# EAGLE schematic DBSchematics (EAGLE 8.2.1)
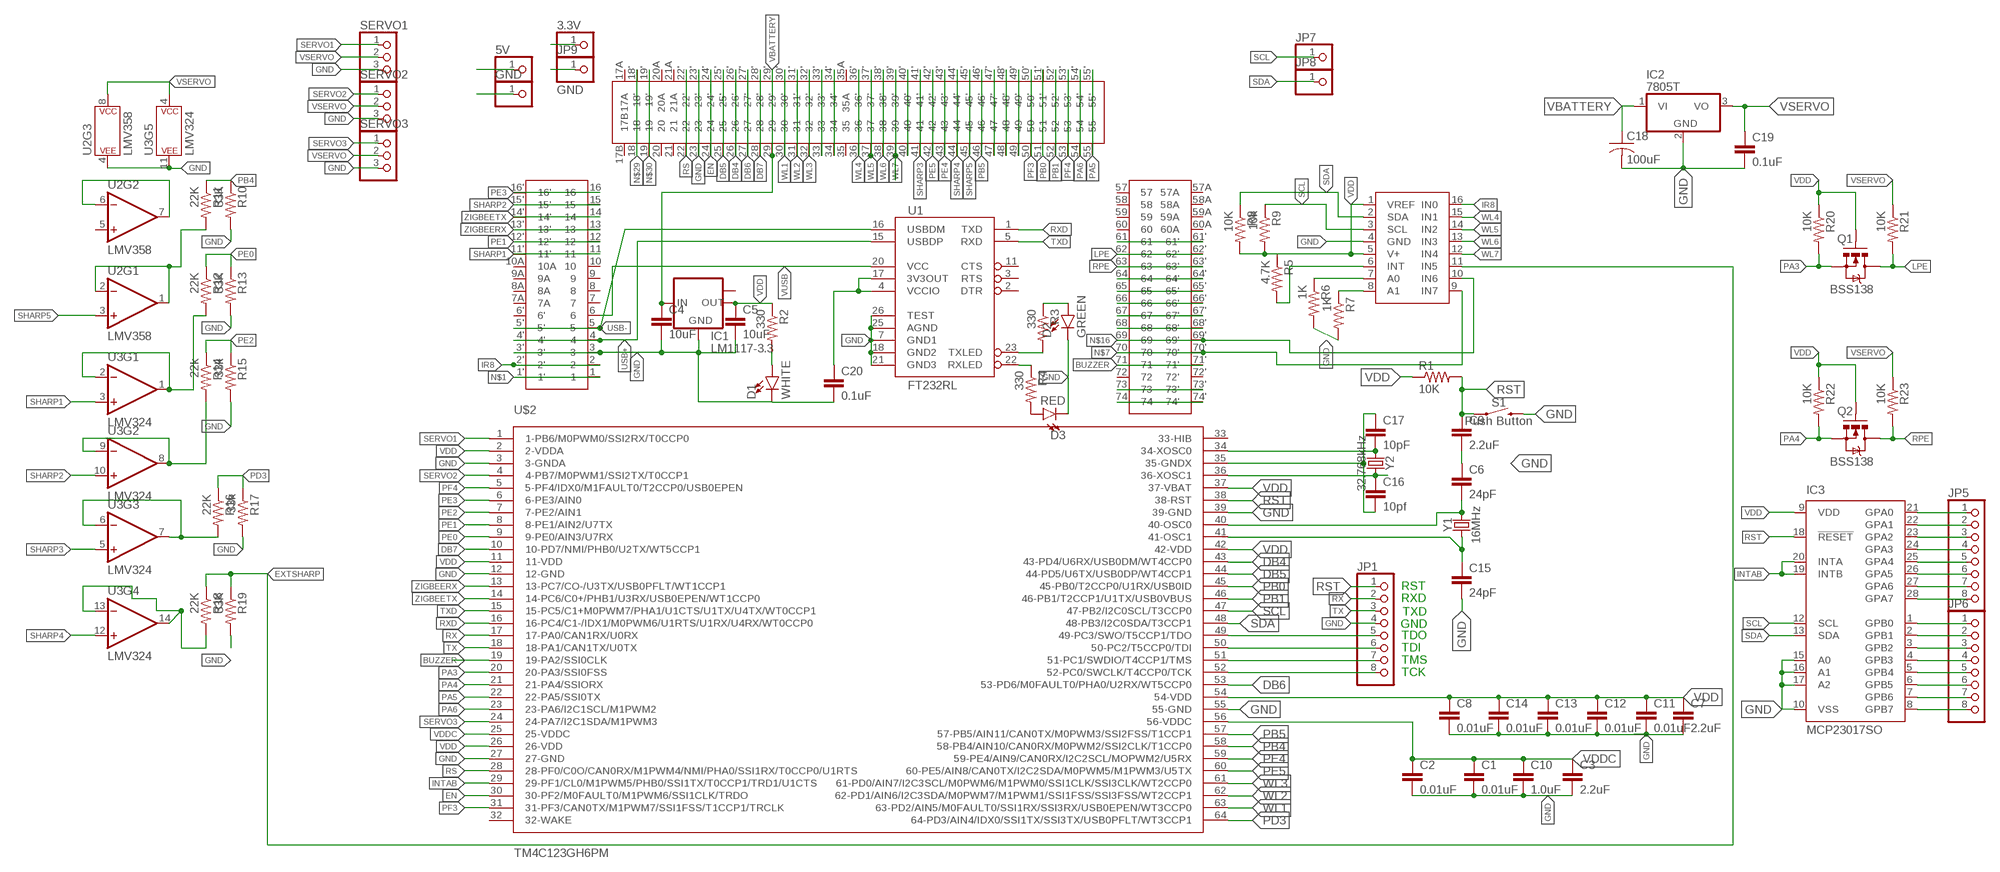
[diagram p0: schematic, sheet 1]

## Parts
3.3V  PINHD-1X1  [1X01]
5V  PINHD-1X1  [1X01]
C1  0.01uF  2.2UF-CERCAP-10009  [1206]
C2  0.01uF  2.2UF-CERCAP-10009  [1206]
C3  2.2uF  2.2UF-1206-50V-10%  [1206]
C4  10uF  10UF-1206-6.3V-20%  [1206]
C5  10uF  10UF-1206-6.3V-20%  [1206]
C6  24pF  2.2UF-CERCAP-10009  [1206]
C7  2.2uF  2.2UF-CERCAP-10009  [1206]
C8  0.01uF  2.2UF-CERCAP-10009  [1206]
C9  2.2uF  2.2UF-1206-50V-10%  [1206]
C10  1.0uF  1.0UF-1206-50V-10%  [1206]
C11  0.01uF  2.2UF-CERCAP-10009  [1206]
C12  0.01uF  2.2UF-CERCAP-10009  [1206]
C13  0.01uF  2.2UF-CERCAP-10009  [1206]
C14  0.01uF  2.2UF-CERCAP-10009  [1206]
C15  24pF  2.2UF-CERCAP-10009  [1206]
C16  10pf  2.2UF-CERCAP-10009  [1206]
C17  10pF  2.2UF-CERCAP-10009  [1206]
C18  100uF  C-US025-024X044  [C025-024X044]
C19  0.1uF  2.2UF-CERCAP-10009  [1206]
C20  0.1uF  10UF-1206-6.3V-20%  [1206]
D1  WHITE  LED-WHITE1206  [LED-1206]
D2  GREEN  LED-WHITE1206  [LED-1206]
D3  RED  LED-WHITE1206  [LED-1206]
GND  PINHD-1X1  [1X01]
IC1  LM1117-3.3  LM1117IMPX-3.3  [SOT223]
IC2  7805T  [TO220H]
IC3  MCP23017SO  [SO28W]
JP1  PINHD-1X8-3.5MM  [1X08-3.5MM]
JP5  PINHD-1X8BIG  [1X08-BIG]
JP6  PINHD-1X8BIG  [1X08-BIG]
JP7  PINHD-1X1  [1X01]
JP8  PINHD-1X1  [1X01]
JP9  GND  PINHD-1X1  [1X01]
Q1  BSS138  MOSFET-NCHANNELSMD  [SOT23-3]
Q2  BSS138  MOSFET-NCHANNELSMD  [SOT23-3]
R1  10K  R-US_M1206  [M1206]
R2  330  R-US_M1206  [M1206]
R3  330  R-US_M1206  [M1206]
R4  330  R-US_M1206  [M1206]
R5  4.7K  R-US_M1206  [M1206]
R6  1K  R-US_M1206  [M1206]
R7  1K  R-US_M1206  [M1206]
R8  10K  R-US_M1206  [M1206]
R9  10k  R-US_M1206  [M1206]
R10  33K  R-US_M1206  [M1206]
R11  22K  R-US_M1206  [M1206]
R12  22K  R-US_M1206  [M1206]
R13  33K  R-US_M1206  [M1206]
R14  22k  R-US_M1206  [M1206]
R15  33k  R-US_M1206  [M1206]
R16  22K  R-US_M1206  [M1206]
R17  33k  R-US_M1206  [M1206]
R18  22K  R-US_M1206  [M1206]
R19  33K  R-US_M1206  [M1206]
R20  10K  RESISTOR1206  [1206]
R21  10K  RESISTOR1206  [1206]
R22  10K  RESISTOR1206  [1206]
R23  10K  RESISTOR1206  [1206]
S1  Push Button  MOMENTARY-SWITCH-SPST-PTH-6.0MM  [TACTILE_SWITCH_PTH_6.0MM]
SERVO1  PINHD-1X3  [1X03]
SERVO2  PINHD-1X3  [1X03]
SERVO3  PINHD-1X3  [1X03]
U1  FT232RL  FT232RL-BASICSSOP  [SSOP28DB]
U2  LMV358  LMV358SOIC  [SO08]
U3  LMV324  [SO14]
U$1  DAUGHTERBOARDDAUGHTERBOARD  [DAUGHTERBOARD]
U$2  TM4C123GH6PM  TM4C123GH6PMS-PQFP-G64  [LQFP]
U$3  ADC128D818  [ADC12_SD]
Y1  16MHz  CRYSTAL-16MHZPTH-HC49US  [HC49US]
Y2  32.768kHz  CRYSTAL-32.768KHZPTH-2X6  [CRYSTAL-PTH-2X6-CYL]

## Nets
BUZZER: U$1.71 U$1.71' U$2.19(19-PA2/SSI0CLK)
DB4: U$1.26 U$1.26' U$2.43(43-PD4/U6RX/USB0DM/WT4CCP0)
DB5: U$1.25 U$1.25' U$2.44(44-PD5/U6TX/USB0DP/WT4CCP1)
DB6: U$1.27 U$1.27' U$2.53(53-PD6/M0FAULT0/PHA0/U2RX/WT5CCP0)
DB7: U$1.28 U$1.28' U$2.10(10-PD7/NMI/PHB0/U2TX/WT5CCP1)
EN: U$1.24 U$1.24' U$2.30(30-PF2/M0FAULT0/M1PWM6/SSI1CLK/TRDO)
EXTSHARP: R18.1 R19.1 U$3.11(IN5)
FDSFSDF: R12.2 U3.1(OUT) U3.2(-IN)
GND [VSERVO]: C1.2 C2.2 C3.2 C4.2 C5.2 C6.1 C7.2 C8.2 C9.2 C10.2 C11.2 C12.2 C13.2 C14.2 C15.2 C18.2 C19.2 C20.2 D1.C D2.C D3.C GND.1 IC1.1(GND) IC2.2(GND) IC3.10(VSS) IC3.15(A0) IC3.16(A1) IC3.17(A2) JP1.4 JP9.1 R6.2 R7.2 R10.2 R13.2 R15.2 R17.2 R19.2 S1.3 SERVO1.3 SERVO2.3 SERVO3.3 U1.7(GND1) U1.18(GND2) U1.21(GND3) U1.25(AGND) U1.26(TEST) U2.4(P$V-) U3.11(P$V-) U$1.3 U$1.3' U$1.23 U$1.23' U$2.3(3-GNDA) U$2.12(12-GND) U$2.27(27-GND) U$2.39(39-GND) U$2.55(55-GND) U$3.4(GND)
GNDX: C16.2 C17.1 U$2.35(35-GNDX)
HGHJ: R11.2 U2.1(OUT) U2.2(-IN)
INTAB: IC3.19(INTB) IC3.20(INTA) U$2.29(29-PF1/CL0/M1PWM5/PHB0/SSI1TX/T0CCP1/TRD1/U1CTS)
IR8: U$1.2 U$1.2' U$3.16(IN0)
LPE: Q1.3(D) R21.2 U$1.62 U$1.62'
N$1: U$1.1 U$1.1'
N$2: IC3.21(GPA0) JP5.1
N$3: C6.2 U$2.40(40-OSC0) Y1.2
N$5: IC3.22(GPA1) JP5.2
N$6: U2.6(-IN) U2.7(OUT)
N$7: U$1.70 U$1.70' U$3.9(IN7)
N$8: IC3.23(GPA2) JP5.3
N$9: IC3.24(GPA3) JP5.4
N$10: IC3.25(GPA4) JP5.5
N$11: JP1.8 U$2.52(52-PC0/SWCLK/T4CCP0/TCK)
N$12: U$1.74 U$1.74'
N$13: U$1.73 U$1.73'
N$14: R18.2 U3.13(-IN) U3.14(OUT)
N$15: JP1.7 U$2.51(51-PC1/SWDIO/T4CCP1/TMS)
N$16: U$1.69 U$1.69' U$3.10(IN6)
N$17: U$1.68 U$1.68'
N$18: U$1.67 U$1.67'
N$19: U$1.66 U$1.66'
N$20: U$1.65 U$1.65'
N$21: U$1.64 U$1.64'
N$22: R6.1 U$3.7(A0)
N$23: IC3.26(GPA5) JP5.6
N$24: U$1.61 U$1.61'
N$25: JP1.6 U$2.50(50-PC2/T5CCP0/TDI)
N$26: D1.A R2.2
N$27: C17.2 U$2.34(34-XOSC0) Y2.1
N$28: C16.1 U$2.36(36-XOSC1) Y2.2
N$29: U$1.18 U$1.18'
N$30: U$1.19 U$1.19'
N$31: JP1.5 U$2.49(49-PC3/SWO/T5CCP1/TDO)
N$32: IC3.27(GPA6) JP5.7
N$33: IC3.28(GPA7) JP5.8
N$34: IC3.1(GPB0) JP6.1
N$35: IC3.2(GPB1) JP6.2
N$36: IC3.3(GPB2) JP6.3
N$37: IC3.4(GPB3) JP6.4
N$38: IC3.5(GPB4) JP6.5
N$39: IC3.6(GPB5) JP6.6
N$40: IC3.7(GPB6) JP6.7
N$41: IC3.8(GPB7) JP6.8
N$42: U$1.33 U$1.33'
N$43: U$1.34 U$1.34'
N$48: U$1.40 U$1.40'
N$55: U$1.47 U$1.47'
N$56: U$1.48 U$1.48'
N$57: U$1.49 U$1.49'
N$67: R4.1 U1.22(RXLED)
N$68: R3.2 U1.23(TXLED)
N$69: D3.A R4.2
N$70: D2.A R3.1
N$71: R5.2 U$3.6(INT)
N$73: R7.1 U$3.8(A1)
N$77: C20.1 U1.4(VCCIO) U1.17(3V3OUT)
NO: C15.1 U$2.41(41-OSC1) Y1.1
PA3: Q1.2(S) R20.2 U$2.20(20-PA3/SSI0FSS)
PA4: Q2.2(S) R22.2 U$2.21(21-PA4/SSIORX)
PA5: U$1.55 U$1.55' U$2.22(22-PA5/SSI0TX)
PA6: U$1.54 U$1.54' U$2.23(23-PA6/I2C1SCL/M1PWM2)
PB0: U$1.51 U$1.51' U$2.45(45-PB0/T2CCP0/U1RX/USB0ID)
PB1: U$1.52 U$1.52' U$2.46(46-PB1/T2CCP1/U1TX/USB0VBUS)
PB4: R10.1 R11.1 U$2.58(58-PB4/AIN10/CAN0RX/M0PWM2/SSI2CLK/T1CCP0)
PB5: U$1.46 U$1.46' U$2.57(57-PB5/AIN11/CAN0TX/M0PWM3/SSI2FSS/T1CCP1)
PD3: R16.1 R17.1 U$2.64(64-PD3/AIN4/IDX0/SSI1TX/SSI3TX/USB0PFLT/WT3CCP1)
PE0: R12.1 R13.1 U$2.9(9-PE0/AIN3/U7RX)
PE1: U$1.12 U$1.12' U$2.8(8-PE1/AIN2/U7TX)
PE2: R14.1 R15.1 U$2.7(7-PE2/AIN1)
PE3: U$1.16 U$1.16' U$2.6(6-PE3/AIN0)
PE4: U$1.43 U$1.43' U$2.59(59-PE4/AIN9/CAN0RX/I2C2SCL/MOPWM2/U5RX)
PE5: U$1.42 U$1.42' U$2.60(60-PE5/AIN8/CAN0TX/I2C2SDA/M0PWM5/M1PWM3/U5TX)
PF3: U$1.50 U$1.50' U$2.31(31-PF3/CAN0TX/M1PWM7/SSI1FSS/T1CCP1/TRCLK)
PF4: U$1.53 U$1.53' U$2.5(5-PF4/IDX0/M1FAULT0/T2CCP0/USB0EPEN)
RPE: Q2.3(D) R23.2 U$1.63 U$1.63'
RS: U$1.22 U$1.22' U$2.28(28-PF0/C0O/CAN0RX/M1PWM4/NMI/PHA0/SSI1RX/T0CCP0/U1RTS)
RST: C9.1 IC3.18(!RESET) JP1.1 R1.2 S1.1 U$2.38(38-RST)
RX: JP1.2 U$2.17(17-PA0/CAN1RX/U0RX)
RXD: U1.1(TXD) U$2.16(16-PC4/C1-/IDX1/M0PWM6/U1RTS/U1RX/U4RX/WT0CCP0)
SCL: IC3.12(SCL) JP7.1 R9.1 U$2.47(47-PB2/I2C0SCL/T3CCP0) U$3.3(SCL)
SDA: IC3.13(SDA) JP8.1 R8.1 U$2.48(48-PB3/I2C0SDA/T3CCP1) U$3.2(SDA)
SDFSDFSD: R14.2 U3.8(OUT) U3.9(-IN)
SERVO1: SERVO1.1 U$2.1(1-PB6/M0PWM0/SSI2RX/T0CCP0)
SERVO2: SERVO2.1 U$2.4(4-PB7/M0PWM1/SSI2TX/T0CCP1)
SERVO3: SERVO3.1 U$2.24(24-PA7/I2C1SDA/M1PWM3)
SHARP1: U3.3(+IN) U$1.11 U$1.11'
SHARP2: U3.10(+IN) U$1.15 U$1.15'
SHARP3: U3.5(+IN) U$1.41 U$1.41'
SHARP4: U3.12(+IN) U$1.44 U$1.44'
SHARP5: U2.3(+IN) U$1.45 U$1.45'
TX: JP1.3 U$2.18(18-PA1/CAN1TX/U0TX)
TXD: U1.5(RXD) U$2.15(15-PC5/C1+M0PWM7/PHA1/U1CTS/U1TX/U4TX/WT0CCP1)
USB+: U1.15(USBDP) U$1.4 U$1.4'
USB-: U1.16(USBDM) U$1.5 U$1.5'
VBATTERY [VSERVO]: C4.1 C18.1 IC1.3(IN) IC2.1(VI) U$1.29 U$1.29'
VDD [VDD]: 3.3V.1 C5.1 C7.1 C8.1 C11.1 C12.1 C13.1 C14.1 IC1.2(OUT) IC3.9(VDD) Q1.1(G) Q2.1(G) R1.1 R2.1 R5.1 R8.2 R9.2 R20.1 R22.1 U$2.2(2-VDDA) U$2.11(11-VDD) U$2.26(26-VDD) U$2.37(37-VBAT) U$2.42(42-VDD) U$2.54(54-VDD) U$3.1(VREF) U$3.5(V+)
VDDC: C1.1 C2.1 C3.1 C10.1 U$2.25(25-VDDC) U$2.56(56-VDDC)
VSERVO [VSERVO]: 5V.1 C19.1 IC2.3(VO) R21.1 R23.1 SERVO1.2 SERVO2.2 SERVO3.2 U2.8(P$V+) U3.4(P$V+)
VUSB: U1.20(VCC) U$1.6
WL1: U$1.30 U$1.30' U$2.63(63-PD2/AIN5/M0FAULT0/SSI1RX/SSI3RX/USB0EPEN/WT3CCP0)
WL2: U$1.31 U$1.31' U$2.62(62-PD1/AIN6/I2C3SDA/M0PWM7/M1PWM1/SSI1FSS/SSI3FSS/WT2CCP1)
WL3: U$1.32 U$1.32' U$2.61(61-PD0/AIN7/I2C3SCL/M0PWM6/M1PWM0/SSI1CLK/SSI3CLK/WT2CCP0)
WL4: U$1.36 U$1.36' U$3.15(IN1)
WL5: U$1.37 U$1.37' U$3.14(IN2)
WL6: U$1.38 U$1.38' U$3.13(IN3)
WL7: U$1.39 U$1.39' U$3.12(IN4)
XXVX: R16.2 U3.6(-IN) U3.7(OUT)
ZIGBEERX: U$1.13 U$1.13' U$2.13(13-PC7/CO-/U3TX/USB0PFLT/WT1CCP1)
ZIGBEETX: U$1.14 U$1.14' U$2.14(14-PC6/C0+/PHB1/U3RX/USB0EPEN/WT1CCP0)
Unconnected: IC1.TAB(OUT1) U1.2(DTR) U1.3(RTS) U1.11(CTS) U2.5(+IN) U$1.6' U$1.7 U$1.7A U$1.8 U$1.8A U$1.9 U$1.9A U$1.10 U$1.10A U$1.17A U$1.17B U$1.20 U$1.20A U$1.21 U$1.21A U$1.35 U$1.35A U$1.57 U$1.57A U$1.58 U$1.58A U$1.59 U$1.59A U$1.60 U$1.60A U$1.72 U$1.72' U$2.32(32-WAKE) U$2.33(33-HIB)

## Notes on the sheet
- RST
- RXD
- TXD
- GND
- TDO
- TDI
- TMS
- TCK

## Library data of the parts
3.3V 5V GND JP7-JP9 = adafruit:PINHD-1X1: Pin header 1x1 for 0.1" spacing With round pins
C1 C2 C6 C8 C11-C17 C19 = SparkFun-Retired:2.2UF-CER: 2.2uF Ceramic SMT CAP-07888- 10V, 20% (0603) CAP-10009- 50V, 10% (1206); PROD_ID: CAP-10009; VALUE: 2.2uF
C3 C9 = SparkFun-Capacitors:2.2UF: 2.2µF ceramic capacitors A capacitor is a passive two-terminal electrical component used to store electrical energy temporarily in an electric field.; PROD_ID: CAP-10009
C4 C5 = SparkFun-Capacitors:10UF: 10.0µF ceramic capacitors A capacitor is a passive two-terminal electrical component used to store electrical energy temporarily in an electric field.; PROD_ID: CAP-10057
C7 = SparkFun-Retired:2.2UF-CER: 2.2uF Ceramic SMT CAP-07888- 10V, 20% (0603) CAP-10009- 50V, 10% (1206); PROD_ID: CAP-10009
C10 = SparkFun-Capacitors:1.0UF: 1µF ceramic capacitors A capacitor is a passive two-terminal electrical component used to store electrical energy temporarily in an electric field.; PROD_ID: CAP-09822
C18 = adafruit:C-US: CAPACITOR, American symbol
C20 = SparkFun-Capacitors:10UF: 10.0µF ceramic capacitors A capacitor is a passive two-terminal electrical component used to store electrical energy temporarily in an electric field.; PROD_ID: CAP-10057; VALUE: 10uF
D1 = SparkFun-LED:LED-WHITE: White SMD LED Used in manufacturing several products at SparkFun. Packages: 0603 - Bright White SMD 0603 package[Product Link] <http://www.kingbrightusa.com/product.asp?catalog_name=LED&product_id=APT1608QWF/D> 1206 - Bright White SMD1206 package [Product Link] <http://www.kingbrightusa.com/product.asp?catalog_name=LED&product_id=APT3216QWF/D> SparkFun Products: Blackberry Trackballer Breakout <https://www.sparkfun.com/products/13169> Digital SandBox <https://www.sparkfun.com/products/12651>; PROD_ID: DIO-09955
D2 D3 = SparkFun-LED:LED-WHITE: White SMD LED Used in manufacturing several products at SparkFun. Packages: 0603 - Bright White SMD 0603 package[Product Link] <http://www.kingbrightusa.com/product.asp?catalog_name=LED&product_id=APT1608QWF/D> 1206 - Bright White SMD1206 package [Product Link] <http://www.kingbrightusa.com/product.asp?catalog_name=LED&product_id=APT3216QWF/D> SparkFun Products: Blackberry Trackballer Breakout <https://www.sparkfun.com/products/13169> Digital SandBox <https://www.sparkfun.com/products/12651>; PROD_ID: DIO-09955; VALUE: WHITE
IC1 = lm1117:LM1117IMPX-*
IC2 = adafruit:78*: Positive VOLTAGE REGULATOR Added bigger pads to the TO-92 package
IC3 = adafruit:MCP23017: http://ww1.microchip.com/downloads/en/DeviceDoc/21952a.pdf Source: http://ww1.microchip.com/downloads/en/DeviceDoc/21952a.pdf
JP1 JP5 JP6 = adafruit:PINHD-1X8: PIN HEADER
Q1 Q2 = SparkFun:MOSFET-NCHANNEL
R1-R19 = adafruit:R-US_: RESISTOR, American symbol
R20-R23 = SparkFun:RESISTOR: Resistor Basic schematic elements and footprints for 0603, 1206, and PTH resistors.
S1 = SparkFun-Switches:MOMENTARY-SWITCH-SPST: Momentary Switch (Pushbutton) - SPST Normally-open (NO) SPST momentary switches (buttons, pushbuttons). Variants PTH-12MM - 12mm square, through-hole Momentary Pushbutton Switch - 12mm Square <https://www.sparkfun.com/products/9190> (COM-09190) PTH-6.0MM, PTH-6.0MM-KIT - 6.0mm square, through-hole Mini Pushbutton Switch <https://www.sparkfun.com/products/97> (COM-00097) KIT package intended for soldering kit's - only one side of pads' copper is exposed. PTH-RIGHT-ANGLE-KIT - Right-angle, through-hole Right Angle Tactile Button <https://www.sparkfun.com/products/10791> - Used on SparkFun BigTime Watch Kit <https://www.sparkfun.com/products/11734> SMD-12MM - 12mm square, surface-mount Tactile Button - SMD (12mm) <https://www.sparkfun.com/products/12993> (COM-12993) Used on SparkFun PicoBoard <https://www.sparkfun.com/products/11888> SMD-4.5MM - 4.5mm Square Trackball Switch Used on SparkFun Blackberry Trackballer Breakout <https://www.sparkfun.com/products/13169> SMD-4.6MMX2.8MM - 4.60mm x 2.80mm, surface mount Used on SparkFun SAMD21 Mini Breakout <https://www.sparkfun.com/products/13664> SMD-5.2MM, SMD-5.2-REDUNDANT - 5.2mm square, surface-mount Mini Pushbutton Switch - SMD <https://www.sparkfun.com/products/8720> (COM-08720) Used on Arduino Pro Mini <https://www.sparkfun.com/products/11114> REDUNDANT package connects both switch circuits together SMD-6.0X3.5MM - 6.0 x 3.5mm, surface mount Momentary Reset Switch SMD <https://www.sparkfun.com/products/8229> (COM-08229) SMD-6.2MM-TALL - 6.2mm square, surface mount Tactile Button - SMD (6mm) <https://www.sparkfun.com/products/12992> Used on SparkFun Digital Sandbox <https://www.sparkfun.com/products/12651> SMD-RIGHT-ANGLE - Right-angle, surface mount Used on SparkFun Block for Intel® Edison - Arduino <https://www.sparkfun.com/products/13036>; PROD_ID: SWCH-08441; SF_SKU: COM-00097
SERVO1-SERVO3 = adafruit:PINHD-1X3: PIN HEADER
U1 = SparkFun-IC-Comms:FT232RL-BASIC: FT232RL USB UART This is the simplified version of the FT232RL unit. Only what you need, nothing you don't. FT232RL 4th Generation USB UART (USB <-> Serial) Controller. Datasheet <http://www.sparkfun.com/datasheets/IC/FT232R_v104.pdf> SparkFun Products Component <https://www.sparkfun.com/products/650> (COM-00650) SparkFun RedBot Mainboard <https://www.sparkfun.com/products/12097> (ROB-12097) SparkFun FTDI Basic Breakout - 5V <https://www.sparkfun.com/products/9716> (DEV-09716) SparkFun FTDI Basic Breakout - 3.3V <https://www.sparkfun.com/products/9873> (DEV-09873) Bus Pirate - v3.6a <https://www.sparkfun.com/products/12942> (TOL-12942) SparkFun USB to Serial Breakout - FT232RL <https://www.sparkfun.com/products/12731> (BOB-12731) SparkFun PicoBoard <https://www.sparkfun.com/products/11888> (WIG-11888) SparkFun RFID USB Reader <https://www.sparkfun.com/products/9963> (SEN-09963) LilyPad FTDI Basic Breakout - 5V <https://www.sparkfun.com/products/10275> (DEV-10275) SparkFun Stepoko <https://www.sparkfun.com/products/13899> (ROB-13899); PROD_ID: IC-00870
U2 = SparkFun-IC-Amplifiers:LMV358: IC LMV358 DUAL OP AMP Jellybean rail-to-rail output op-amp SparkFun Products SparkFun PicoBoard <https://www.sparkfun.com/products/11888> (WIG-11888) SparkFun Vernier Interface Shield <https://www.sparkfun.com/products/12858> (DEV-12858) SparkFun Blynk Board - ESP8266 <https://www.sparkfun.com/products/13794> (WRL-13794) SparkFun Digital Sandbox <https://www.sparkfun.com/products/12651> (DEV-12651 RoHS); PROD_ID: IC-09657
U3 = SparkFun-IC-Amplifiers:LMV324: IC LMV324 Quad Op Amp Jellybean quad op-amp Datasheet <http://cdn.sparkfun.com/datasheets/Sensors/Sound/LMV324.pdf> SparkFun Products SparkFun Sensor Kit <https://www.sparkfun.com/products/13754> (DEV-13754) SparkFun Inventor's Kit for Arduino 101 <https://www.sparkfun.com/products/13844> (KIT-13844) SparkFun Sound Detector <https://www.sparkfun.com/products/12642> (SEN-12642); PROD_ID: IC-08227
U$1 = Daughterboard:DAUGHTERBOARD
U$2 = TM4C123GH6PM:TM4C123GH6PM
U$3 = ADC128D818:ADC128D818
Y1 = SparkFun-Clocks:CRYSTAL-16MHZ: 16MHz Crystal Digikey Example <http://www.digikey.com/product-search/en?keywords=535-9122-1-ND> Frequency: 16MHz Frequency Stability: ±50ppm Frequency Tolerance: ±20ppm Load Capacitance: 18pF SparkFun Products: Pro Micro -5V/16MHz <https://www.sparkfun.com/products/12640> SparkFun Serial Enabled LCD Kit <https://www.sparkfun.com/products/10097>; PROD_ID: XTAL-08181; SF_ID: COM-00536
Y2 = SparkFun-Clocks:CRYSTAL-32.768KHZ: 32.768kHz Crystal Frequency: 32.768kHz Frequency Stability: ±20ppm Load Capacitance: 12.5pF (PTH-2X6 & SMD-3.2X1.5), 6pF (SMD-2X6) SparkFun Products: SparkFun BigTime Watch Kit <https://www.sparkfun.com/products/11734> SparkFun nRF52832 Breakout <https://www.sparkfun.com/products/13990> SparkFun Real Time Clock Module <https://www.sparkfun.com/products/12708>; PROD_ID: XTAL-10112

## Net classes
0 default: width 0.2 mm, clearance 0.2 mm
1 VSERVO: width 0.8 mm, clearance 0.2 mm
2 VDD: width 0.5 mm, clearance 0.2 mm